# Altium schematic sheet HallSensor.SchDoc
size A4; SheetNumber: 1; SheetTotal: 3
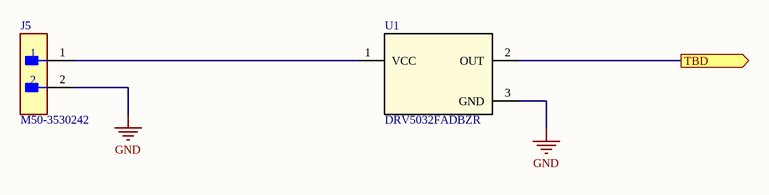
[diagram p0: HallSensor.SchDoc]

## Parts
J5  M50-3530242  [FP-M50-3530242-MFG]
U1  DRV5032FADBZR  [DBZ0003A-IPC_A]

## Ports
TBD (out)

## Nets
GND: J5.2 U1.3(GND)
TBD: U1.2(OUT) ; port TBD
NetJ5_1: J5.1 U1.1(VCC)

## Library data of the parts
J5 = CMP-15831-000040-1: CONN HEADER VERT 2POS 1.27MM
U1 = DRV5032FADBZR: Low-power (5Hz, <1ÂµA) low-voltage (up to 5.5V) switch 3-SOT-23 -40 to 85; Manufacturer_Name: Texas Instruments; TYPE: TYPE; RefDes: RefDes; Copyright: Copyright (C) 2026 Ultra Librarian. All rights reserved.; Manufacturer_Part_Number: DRV5032FADBZR; Datasheet: https://www.ti.com/lit/gpn/drv5032